# Altium schematic sheet communication.SchDoc
size A
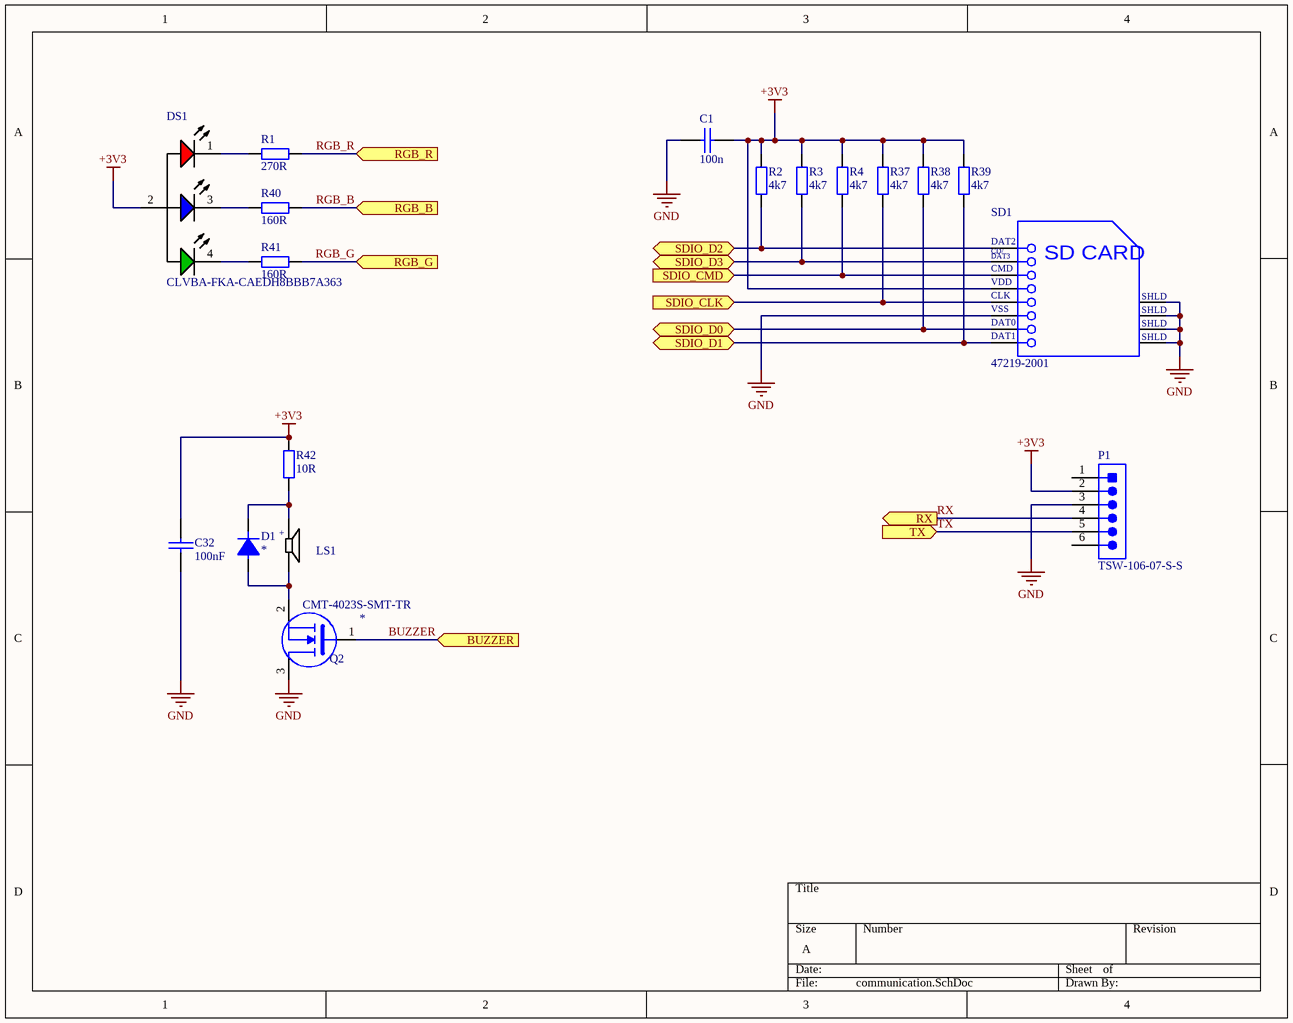
[diagram p0: communication.SchDoc]

## Parts
C1  100n  [C0603_PASTE]
C32  100nF  [C0402-Paste]
D1  *  [SOD123]
DS1  CLVBA-FKA-CAEDH8BBB7A363  [CLVBA-FKA_RGB_A_V]
LS1  CMT-4023S-SMT-TR  [*CUI_CMT-4023S-SMT-TR_CMT-4023S-SMT-TR(Primary)]
P1  TSW-106-07-S-S  [SMTC-TSW-106-07-S-S_V]
Q2  *  [SOT-23]
R1  270R  [R0603_PASTE]
R2  4k7  [R0603_PASTE]
R3  4k7  [R0603_PASTE]
R4  4k7  [R0603_PASTE]
R37  4k7  [R0603_PASTE]
R38  4k7  [R0603_PASTE]
R39  4k7  [R0603_PASTE]
R40  160R  [R0603_PASTE]
R41  160R  [R0603_PASTE]
R42  10R  [R0603_PASTE]
SD1  47219-2001  [MOLX-47219-2001-8_V]

## Ports
BUZZER (in), RGB_B (in), RGB_G (in), RGB_R (in), RX (out), SDIO_CLK (in), SDIO_CMD (in), SDIO_D0 (bidir), SDIO_D1 (bidir), SDIO_D2 (bidir), SDIO_D3 (bidir), TX (in)

## Nets
+3V3: C1.1 C32.2 DS1.2(COMMON) P1.2 R2.1 R3.1 R4.1 R37.1 R38.1 R39.1 R42.1 SD1.4(VDD)
GND: C1.2 C32.1 P1.3 Q2.3(SOURCE) SD1.6(VSS) SD1.9(SHLD) SD1.10(SHLD) SD1.11(SHLD) SD1.12(SHLD)
BUZZER: Q2.1(GATE) ; port BUZZER
RGB_B: R40.1 ; port RGB_B
RGB_G: R41.1 ; port RGB_G
RGB_R: R1.1 ; port RGB_R
RX: P1.4 ; port RX
SDIO_CLK: R37.2 SD1.5(CLK) ; port SDIO_CLK
SDIO_CMD: R4.2 SD1.3(CMD) ; port SDIO_CMD
SDIO_D0: R38.2 SD1.7(DAT0) ; port SDIO_D0
SDIO_D1: R39.2 SD1.8(DAT1) ; port SDIO_D1
SDIO_D2: R2.2 SD1.1(DAT2) ; port SDIO_D2
SDIO_D3: R3.2 SD1.2(CD/DAT3) ; port SDIO_D3
TX: P1.5 ; port TX
NetD1_A: D1.A LS1.N Q2.2(DRAIN)
NetD1_K: D1.K LS1.P R42.2
NetDS1_1: DS1.1(RED) R1.2
NetDS1_3: DS1.3(BLUE) R40.2
NetDS1_4: DS1.4(GREEN) R41.2

Not connected (* = marked no-connect by the designer): P1 1 6

## Notes on the sheet
- (in symbol CMP-2000-05245-1) CD/; DAT3; SD CARD
- (in symbol CMT-4023S-SMT-TR) +

## Library data of the parts
C1 = C-0603: Multilayer Ceramic Capacitors MLCC - SMD 0603; Value: 100n; Manufacturer: -; Manufacturer PN: -; Supplier: digikey.ca
C32 = C-0402: CAP CER 0.1UF 16V Y5V 0402; Manufacturer: Samsung Electro-Mechanics; Manufacturer PN: CL05F104ZO5NNNC; Value: 100nF; Supplier: digikey.ca
D1 = DIODE: Common Diode; Manufacturer: ON Semiconductor; Manufacturer PN: LL4148; Value: *; Supplier: digikey.ca
DS1 = CMP-2000-06112-1: 3-in-1 SMD Led, 1.9 V Red, 3 V Green, 3 V Blue, -40 to 100 degC, 4-Pin PLCC, RoHS, Reel; Luminous Intensity: 71mcd,140mcd,36mcd; Viewing Angle: 120deg; Brand: Cree,Inc.; Lens Color/Style: UVTinted; Forward Current: 20mA; LED Size: 3.2mmx2.8mmx1.9mm; Wavelength/Color Temperature: 630nm,527nm,470nm; Forward Voltage: 1.9V,3V,3V; Illumination Color: RGB; Package / Case: PLCC-4; Package Reference: PLCC-4; Packaging: Reel; Maximum Operating Temperature: +100C; Minimum Operating Temperature: -40C; Product Category: StandardLEDs-SMD; Manufacturer URL: http://www.cree.com/; RoHS: Details; Factory Pack Quantity: 2000; Datasheet URL: http://datasheet.octopart.com/CLVBA-FKA-CAEDH8BBB7A363-Cree-datasheet-44497822.pdf; Manufacturer: Cree,Inc.; Mounting Technology: SurfaceMount; Package Description: 4-Pin Plastic Leaded Chip Carrier, Body 3.2 x 2.8 mm; Datasheet Version: 12/2014
LS1 = CMT-4023S-SMT-TR: 4 mm, 3 Vo-p, 70 dB, Surface Mount _SMT_, Magnetic Audio Transducer Buzzer; MF: CUI Devices; CUI_purchase_URL: https://www.cuidevices.com/product/audio/buzzers/audio-transducers/cmt-4023s-smt-tr?utm_source=snapeda.com&utm_medium=referral&utm_campaign=snapedaBOM; SnapEDA_Link: https://www.snapeda.com/parts/CMT-4023S-SMT-TR/CUI%20Devices/view-part/612102/?ref=snap; Availability: Unavailable; Price: None; Package: SIP-1 CUI; MP: CMT-4023S-SMT-TR; Value: *
P1 = CMP-1681-00007-2: Male Header, Pitch 2.54 mm, 1 x 6 Position, Height 8.38 mm, Tail Length 2.54 mm, -55 to 125 degC, RoHS, Bulk; Manufacturer: Samtec; Rows: 1; Contact Finish: Gold; Lead Pitch: 0.1 inch; Package Quantity: 1; Mounting Technology: Through Hole; ComponentLink1Description: Manufacturer URL; Contact Plating: Gold; DatasheetVersion: 12/2015; ComponentLink3Description: Package Specification; PackageDescription: Male Header, Pitch 2.54 mm, 1 x 6 Position, Height 8.38 mm, Tail Length 2.54 mm; Height: 8.38 mm; ComponentLink2Description: Datasheet; RoHSCompliant: true; Colour: Black; Packaging: Bulk; Min Operating Temperature: -55 degC; ComponentLink2URL: http://suddendocs.samtec.com/catalog_english/tsw_th.pdf; Mount: Through Hole; PackageReference: TSW-102-07-S-S; Pins: 6; Max Operating Temperature: 125 degC; ComponentLink3URL: http://suddendocs.samtec.com/prints/tsw-xxx-xx-x-x-xx-xxx-footprint.pdf; Length: 15.24 mm; Contact Material: Bronze; ComponentLink1URL: http://www.samtec.com/
Q2 = MOSFET-N: MOSFET N-CH  SOT23; Manufacturer PN: BSN20-7; Manufacturer: Diodes Incorporated; Value: *; Supplier: digikey.ca
R1-R4 R37-R42 = R-0603: RES SMD 0603; Manufacturer: -; Manufacturer PN: -; Supplier: digikey.ca
  R1: Value: 270R
  R2-R4 R37-R39: Value: 4k7
  R40 R41: Value: 160R
  R42: Value: 10R
SD1 = CMP-2000-05245-1: MicroSD Card Connector, Hinge Type, -40 to 85 degC, 8-Pin SMD, RoHS, Tape and Reel; Manufacturer: Molex; Current Rating: 500mA; Number of Contacts: 8; Pitch: 1.09mm; Insertion - Extraction Style: Hinged; Voltage Rating: 100VDC; Product: CardConnectors; Contact Material: CopperAlloy; Series: 47219; Packaging: Reel; Brand: Molex; Product Category: MemoryCardConnectors; Housing Material: Thermoplastic; Mounting Style: SMD/SMT; Termination Style: SMD; Datasheet Version: Rev. F, 06/2009; Card Type: microSD; Manufacturer URL: http://www.molex.com/; RoHS: Details; Datasheet URL: http://www.molex.com/pdm_docs/sd/472192001_sd.pdf; Factory Pack Quantity: 2400